# EAGLE design Output (EAGLE 9.2.2)
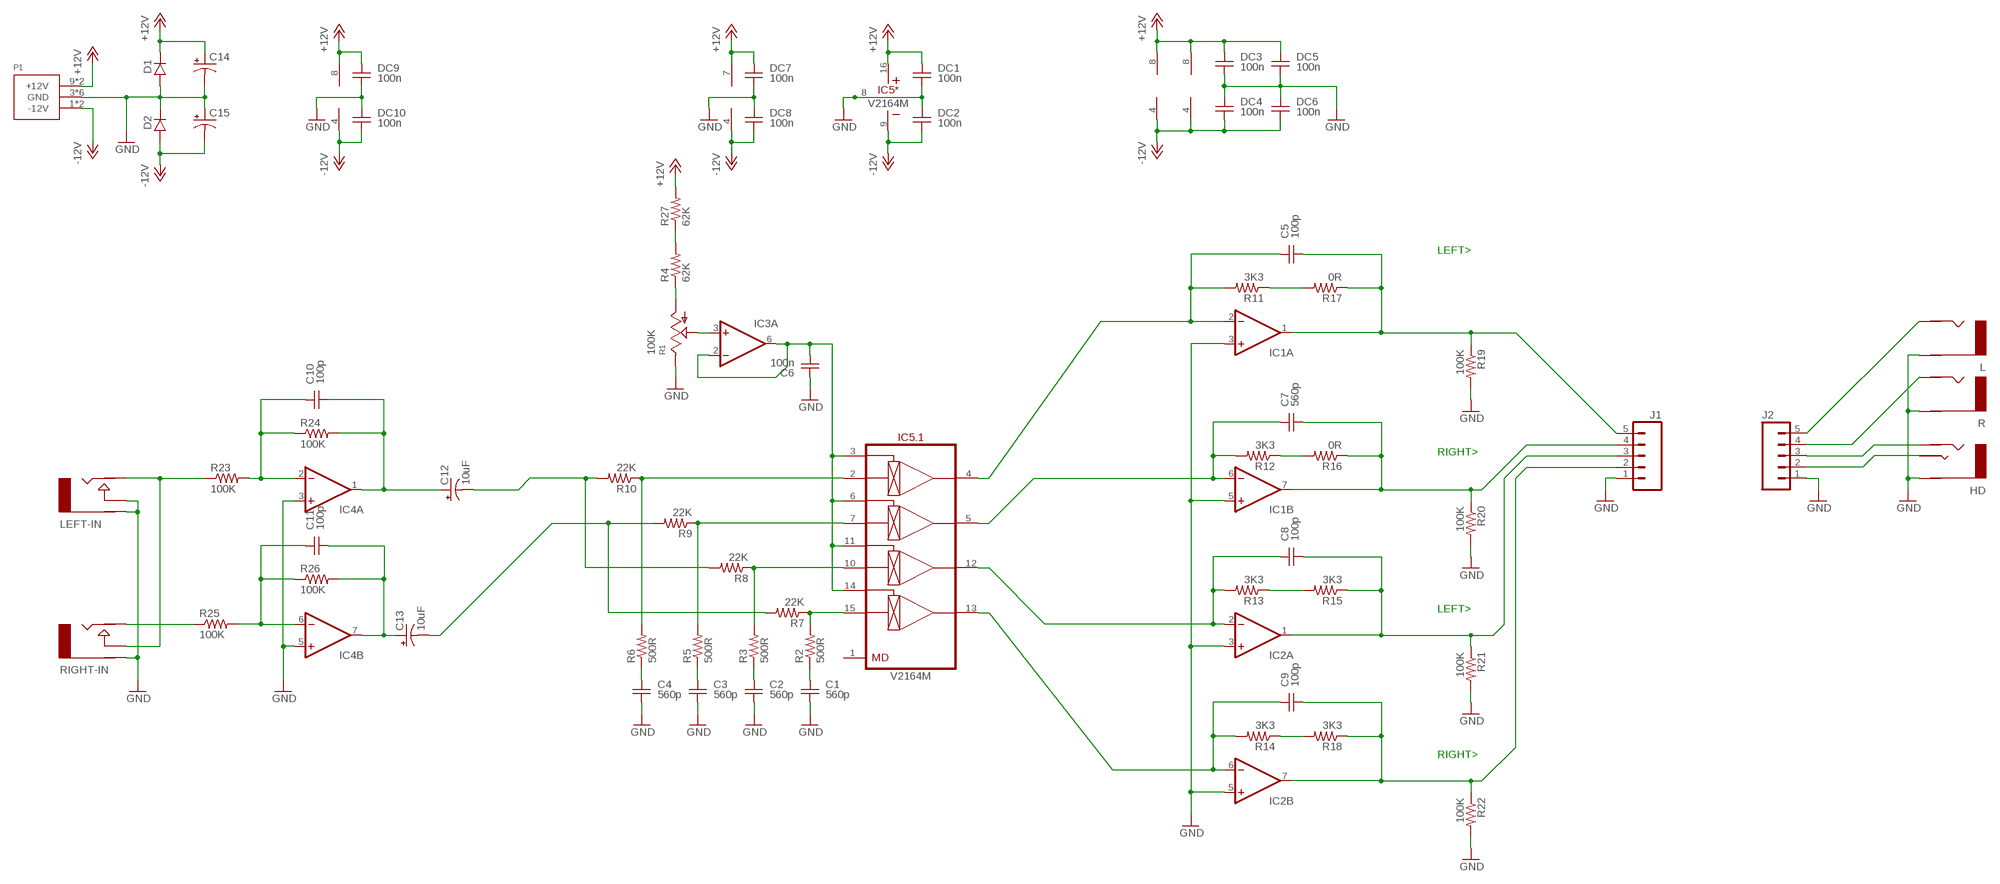
[diagram p0: schematic, sheet 1]

## Parts
C1  560p  CAPACITOR0805  [C-0805]
C2  560p  CAPACITOR0805  [C-0805]
C3  560p  CAPACITOR0805  [C-0805]
C4  560p  CAPACITOR0805  [C-0805]
C5  100p  CAPACITOR0805  [C-0805]
C6  100n  CAPACITOR0805  [C-0805]
C7  560p  CAPACITOR0805  [C-0805]
C8  100p  CAPACITOR0805  [C-0805]
C9  100p  CAPACITOR0805  [C-0805]
C10  100p  CAPACITOR0805  [C-0805]
C11  100p  CAPACITOR0805  [C-0805]
C12  10uF  CAP_POLC  [PANASONIC_C]
C13  10uF  CAP_POLC  [PANASONIC_C]
C14  CAP_POLPTH2  [CPOL-RADIAL-10UF-25V]
C15  CAP_POLPTH2  [CPOL-RADIAL-10UF-25V]
D1  DIODESMA  [SMA]
D2  DIODESMA  [SMA]
DC1  100n  CAPACITOR0805  [C-0805]
DC2  100n  CAPACITOR0805  [C-0805]
DC3  100n  CAPACITOR0805  [C-0805]
DC4  100n  CAPACITOR0805  [C-0805]
DC5  100n  CAPACITOR0805  [C-0805]
DC6  100n  CAPACITOR0805  [C-0805]
DC7  100n  CAPACITOR0805  [C-0805]
DC8  100n  CAPACITOR0805  [C-0805]
DC9  100n  CAPACITOR0805  [C-0805]
DC10  100n  CAPACITOR0805  [C-0805]
HD  AUDIO-JACK_STEREO  [NJ3FD]
IC1  OPAMP-DUAL  [SO08]
IC2  OPAMP-DUAL  [SO08]
IC3  OPAMP-SINGLE  [SO08]
IC4  OPAMP-DUAL  [SO08]
IC5  V2164M  [SO-16]
J1  CONN2  M05LOCK  [1X05_LOCK]
J2  CONN  M05LOCK  [1X05_LOCK]
L  AUDIO-JACK-MONO  [NJ2FD]
LEFT-IN  AUDIO-JACKINLINE  [ERTHENVAR-JACK-INLINE]
P1  POWER_SIMPLE10_SHROUDED  [POWER_10_SHROUDED]
R  AUDIO-JACK-MONO  [NJ2FD]
R1  100K  POTALPHA-9MM  [POT-ALPHA-9MM]
R2  500R  RESISTOR0805  [R-0805-MILL]
R3  500R  RESISTOR0805  [R-0805-MILL]
R4  62K  RESISTOR0805  [R-0805-MILL]
R5  500R  RESISTOR0805  [R-0805-MILL]
R6  500R  RESISTOR0805  [R-0805-MILL]
R7  22K  RESISTOR0805  [R-0805-MILL]
R8  22K  RESISTOR0805  [R-0805-MILL]
R9  22K  RESISTOR0805  [R-0805-MILL]
R10  22K  RESISTOR0805  [R-0805-MILL]
R11  3K3  RESISTOR0805  [R-0805-MILL]
R12  3K3  RESISTOR0805  [R-0805-MILL]
R13  3K3  RESISTOR0805  [R-0805-MILL]
R14  3K3  RESISTOR0805  [R-0805-MILL]
R15  3K3  RESISTOR0805  [R-0805-MILL]
R16  0R  RESISTOR0805  [R-0805-MILL]
R17  0R  RESISTOR0805  [R-0805-MILL]
R18  3K3  RESISTOR0805  [R-0805-MILL]
R19  100K  RESISTOR0805  [R-0805-MILL]
R20  100K  RESISTOR0805  [R-0805-MILL]
R21  100K  RESISTOR0805  [R-0805-MILL]
R22  100K  RESISTOR0805  [R-0805-MILL]
R23  100K  RESISTOR0805  [R-0805-MILL]
R24  100K  RESISTOR0805  [R-0805-MILL]
R25  100K  RESISTOR0805  [R-0805-MILL]
R26  100K  RESISTOR0805  [R-0805-MILL]
R27  62K  RESISTOR0805  [R-0805-MILL]
RIGHT-IN  AUDIO-JACKINLINE  [ERTHENVAR-JACK-INLINE]

## Nets
+12V: C14.1(+) D1.K(C) DC1.1 DC3.1 DC5.1 DC7.1 DC9.1 IC1.8(POWER:V+) IC2.8(POWER:V+) IC3.7(POWER:V+) IC4.8(POWER:V+) IC5.16(*:V+) P1.9(+12V) P1.10(+12V) R27.P$2
-12V: C15.2(-) D2.A DC2.2 DC4.2 DC6.2 DC8.2 DC10.2 IC1.4(POWER:V-) IC2.4(POWER:V-) IC3.4(POWER:V-) IC4.4(POWER:V-) IC5.9(*:V-) P1.1(-12V) P1.2(-12V)
GND: C1.2 C2.2 C3.2 C4.2 C6.1 C14.2(-) C15.1(+) D1.A D2.K(C) DC1.2 DC2.1 DC3.2 DC4.1 DC5.2 DC6.1 DC7.2 DC8.1 DC9.2 DC10.1 HD.R(RING) IC1.3(A:+IN) IC1.5(B:+IN) IC2.3(A:+IN) IC2.5(B:+IN) IC4.3(A:+IN) IC4.5(B:+IN) IC5.8(*:GND) J1.1 J2.1 L.S(RING) LEFT-IN.G(RING) LEFT-IN.N(NORM) P1.3(GND) P1.4(GND) P1.5(GND) P1.6(GND) P1.7(GND) P1.8(GND) R1.B(E) R19.P$2 R20.P$2 R21.P$2 R22.P$2 R.S(RING) RIGHT-IN.G(RING)
LEFT-IN: LEFT-IN.T(TIP) R23.P$1 RIGHT-IN.N(NORM)
LEFT-IN-BUFF: C12.- R8.P$2 R10.P$2
N$1: R1.A R4.P$1
N$2: IC5.2(.1:IN1) R6.P$2 R10.P$1
N$3: C6.2 IC3.2(A:-IN) IC3.6(A:OUT) IC5.3(.1:CV1) IC5.6(.1:CV2) IC5.11(.1:CV3) IC5.14(.1:CV4)
N$4: IC5.7(.1:IN2) R5.P$2 R9.P$1
N$5: IC5.10(.1:IN3) R3.P$2 R8.P$1
N$6: IC5.15(.1:IN4) R2.P$2 R7.P$1
N$7: C1.1 R2.P$1
N$8: J2.5 L.T(TIP)
N$9: C2.1 R3.P$1
N$10: C3.1 R5.P$1
N$11: C4.1 R6.P$1
N$12: R14.P$1 R18.P$2
N$13: C9.2 IC2.7(B:OUT) J1.2 R18.P$1 R22.P$1
N$14: J2.4 R.T(TIP)
N$15: C5.1 IC1.2(A:-IN) IC5.4(.1:OUT1) R11.P$2
N$16: C7.1 IC1.6(B:-IN) IC5.5(.1:OUT2) R12.P$2
N$17: C8.1 IC2.2(A:-IN) IC5.12(.1:OUT3) R13.P$2
N$18: C9.1 IC2.6(B:-IN) IC5.13(.1:OUT4) R14.P$2
N$19: C5.2 IC1.1(A:OUT) J1.5 R17.P$1 R19.P$1
N$20: IC3.3(A:+IN) R1.W(S)
N$21: R13.P$1 R15.P$2
N$22: C7.2 IC1.7(B:OUT) J1.4 R16.P$1 R20.P$1
N$23: R12.P$1 R16.P$2
N$24: C8.2 IC2.1(A:OUT) J1.3 R15.P$1 R21.P$1
N$25: R11.P$1 R17.P$2
N$26: HD.T(TIP) J2.3
N$27: HD.S(SLEEVE) J2.2
N$28: C10.1 IC4.2(A:-IN) R23.P$2 R24.P$1
N$29: C11.1 IC4.6(B:-IN) R25.P$2 R26.P$1
N$30: C10.2 C12.+ IC4.1(A:OUT) R24.P$2
N$31: C11.2 C13.+ IC4.7(B:OUT) R26.P$2
N$32: R4.P$2 R27.P$1
RIGHT-IN: R25.P$1 RIGHT-IN.T(TIP)
RIGHT-IN-BUFF: C13.- R7.P$2 R9.P$2
Unconnected: IC5.1(.1:MD)

## Notes on the sheet
- LEFT>
- RIGHT>
- LEFT>
- RIGHT>

## Library data of the parts
C1-C11 DC1-DC10 = barsstronics:CAPACITOR
C12 C13 = SparkFun-Passives:CAP_POL: Capacitor Polarized These are standard SMD and PTH capacitors. Normally 10uF, 47uF, and 100uF in electrolytic and tantalum varieties. Always verify the external diameter of the through hole cap, it varies with capacity, voltage, and manufacturer. The EIA devices should be standard.
C14 C15 = SparkFun-Capacitors:CAP_POL: Capacitor Polarized These are standard SMD and PTH capacitors. Normally 10uF, 47uF, and 100uF in electrolytic and tantalum varieties. Always verify the external diameter of the through hole cap, it varies with capacity, voltage, and manufacturer. The EIA devices should be standard.
D1 D2 = barsstronics:DIODE
HD = barsstronics:AUDIO-JACK_STEREO
IC1 IC2 IC4 = barsstronics:OPAMP-DUAL: Generic Dual Op-Amp
IC3 = barsstronics:OPAMP-SINGLE
IC5 = ic-coolaudio:V2164
J1 J2 = SparkFun-Connectors:M05: Header 5 Standard 5-pin 0.1" header. Use with straight break away headers (SKU : PRT-00116), right angle break away headers (PRT-00553), swiss pins (PRT-00743), machine pins (PRT-00117), and female headers (PRT-00115). Molex polarized connector foot print use with SKU : PRT-08230 with associated crimp pins and housings.
L R = barsstronics:AUDIO-JACK-MONO
LEFT-IN RIGHT-IN = erthenvar:AUDIO-JACK: Switching Mono 3.5mm Audio Jack from Erthenvar. Horizontal package.
P1 = eurorack:POWER_SIMPLE
R1 = barsstronics:POT
R2-R27 = barsstronics:RESISTOR

## Board
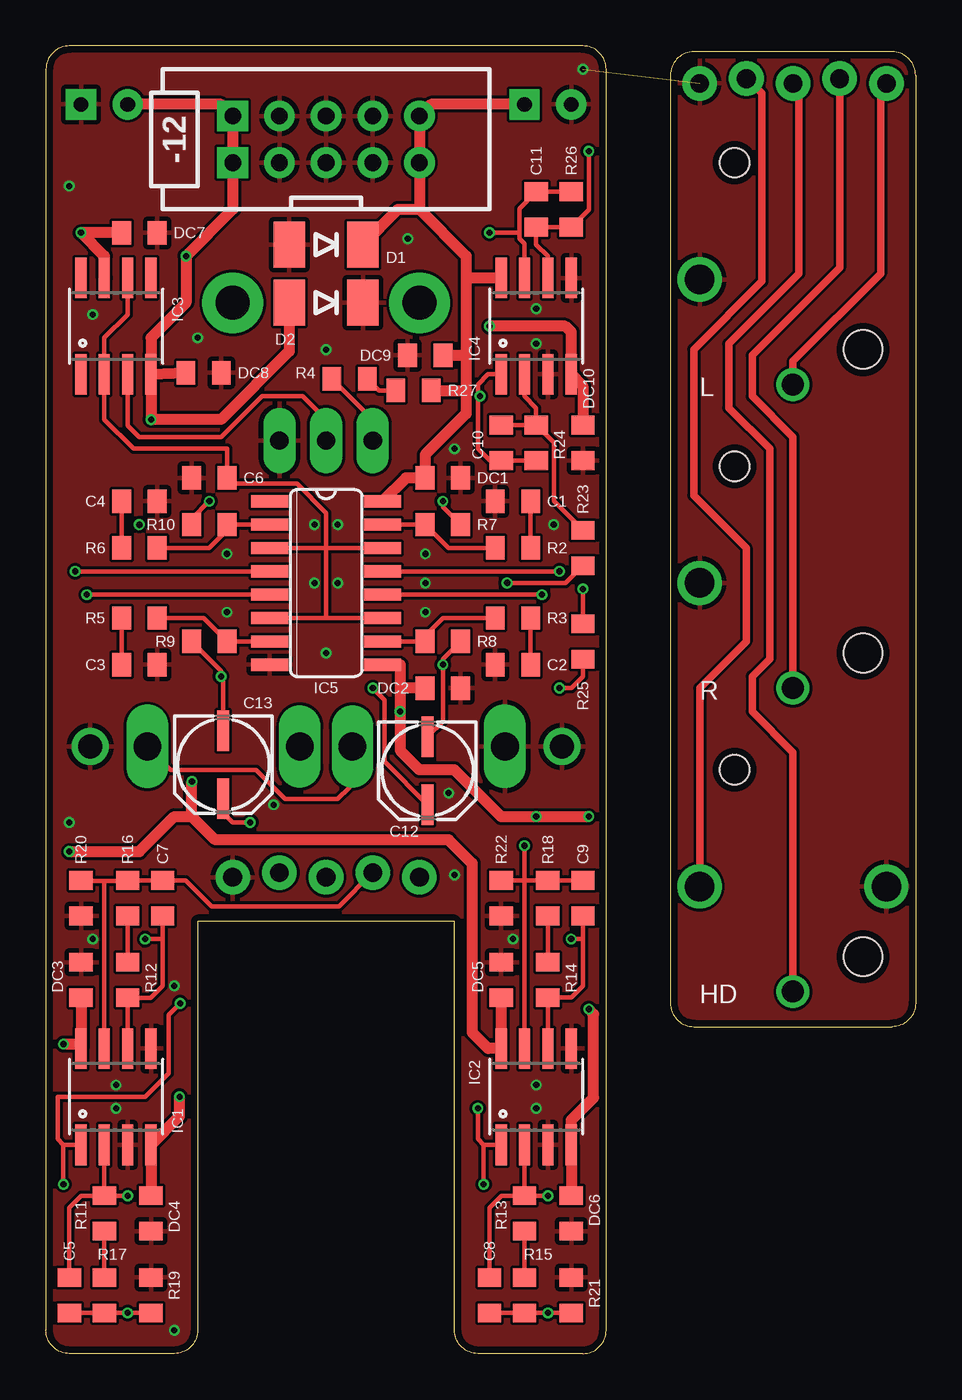
[diagram p1: board, top side]
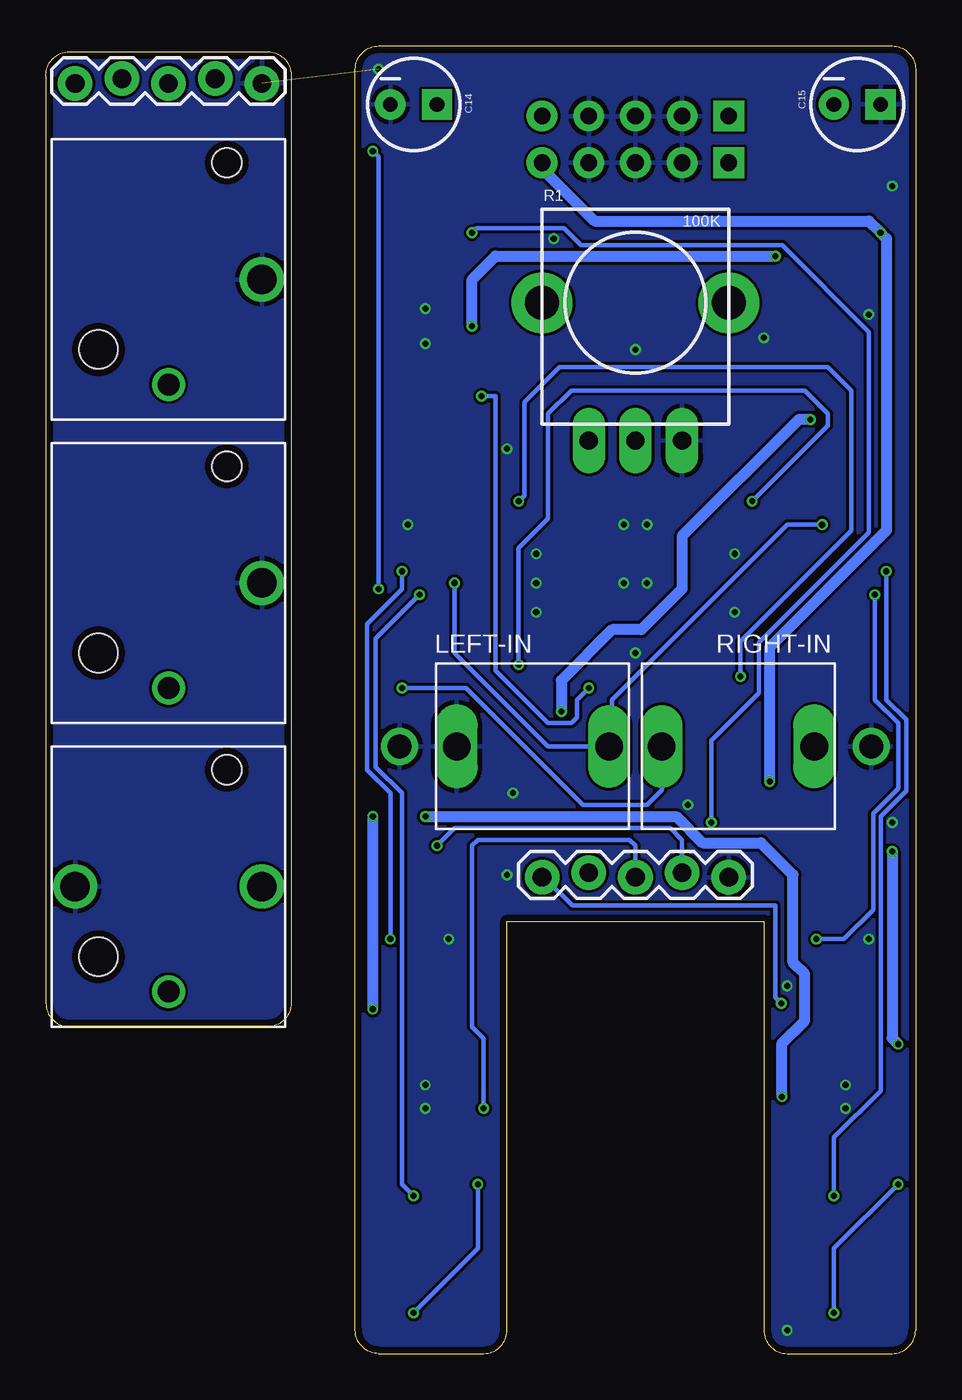
[diagram p2: board, bottom side, seen from below]

Size 47.31 x 71.12 mm. Coordinates in mm from the lower left corner, seen from the top.
Outline: 8.26,23.5 8.26,1.27 arc-90 6.99,0 1.27,0 arc-90 0,1.27 0,69.85 arc-90 1.27,71.12 29.21,71.12 arc-90 30.48,69.85 30.48,1.27 arc-90 29.21,0 23.5,0 arc-90 22.23,1.27 22.23,23.5 8.26,23.5
Outline: 47.31,69.53 47.31,19.05 arc-90 46.04,17.78 35.24,17.78 arc-90 33.97,19.05 33.97,69.53 arc-90 35.24,70.8 46.04,70.8 arc-90 47.31,69.53
Copper layers (1*16): Top 0.035559375mm / dielectric 1.6mm / Bottom 0.035559375mm
Design rules "oshpark-2layer": minimum track width 6mil, minimum drill 10mil, track to track 6mil, track to pad 6mil, pad to pad 6mil, via to via 6mil, smd to smd 6mil, copper to edge 15mil, drill to drill 6mil, minimum pad ring 5mil, minimum via ring 5mil, stop-mask expansion 2.5mil, vias tented up to drill 0mil, thermal gap 10mil

### Footprints (pad centres in the part's own frame; a part is rotated, then mirrored left to right if it is on the bottom)
C-0805 = smd 1.016 x 1.27: 1 -0.965,0; 2 0.965,0
PANASONIC_C = smd 2.2 x 0.65: + 1.9,-0.2; - -1.8,-0.2
CPOL-RADIAL-10UF-25V = drill 0.8 pad 1.651 square: 1 1.27,0 | drill 0.8 pad 1.651: 2 -1.27,0
SMA = smd 1.7 x 2.5: A -2,0; K 2,0
NJ3FD = drill 1.6: R -5.08,0; S 5.08,0 | drill 1.194: T 0,-5.715 | hole 2.108: -3.81,-3.81 | hole 1.6: 3.175,6.35
SO08 = smd 0.61 x 2.21: 1 -1.905,-2.616; 2 -0.635,-2.616; 3 0.635,-2.616; 4 1.905,-2.616; 5 1.905,2.616; 6 0.635,2.616; 7 -0.635,2.616; 8 -1.905,2.616
SO-16 = smd 0.66 x 2.032: 1 -4.445,-3.073; 2 -3.175,-3.073; 3 -1.905,-3.073; 4 -0.635,-3.073; 5 0.635,-3.073; 6 1.905,-3.073; 7 3.175,-3.073; 8 4.445,-3.073; 9 4.445,3.073; 10 3.175,3.073; 11 1.905,3.073; 12 0.635,3.073; 13 -0.635,3.073; 14 -1.905,3.073; 15 -3.175,3.073; 16 -4.445,3.073
1X05_LOCK = drill 1.016 pad 1.88: 1 0,0.127; 2 2.54,-0.127; 3 5.08,0.127; 4 7.62,-0.127; 5 10.16,0.127
NJ2FD = drill 1.6: S 5.08,0 | drill 1.194: T 0,-5.715 | hole 2.108: -3.81,-3.81 | hole 1.6: 3.175,6.35
ERTHENVAR-JACK-INLINE = drill 1.3 pad 2.032: G 0,-6.48 | drill 1.5 pad 2.286 long: N 0,-3.38 | drill 1.5 pad 2.235 long: T 0,4.92
POWER_10_SHROUDED = drill 0.9 pad 1.676 square: 1 -5.08,-1.27; 2 -5.08,1.27 | drill 0.9 pad 1.676: 3 -2.54,-1.27; 4 -2.54,1.27; 5 0,-1.27; 6 0,1.27; 7 2.54,-1.27; 8 2.54,1.27; 9 5.08,-1.27; 10 5.08,1.27
POT-ALPHA-9MM = drill 1 pad 1.778 long: A -2.54,-7.493; B 2.54,-7.493; W 0,-7.493 | drill 1.85 pad 3.302: MNT1 -5.08,0; MNT2 5.08,0
R-0805-MILL = smd 1.016 x 1.27: P$1 -0.965,0; P$2 0.965,0

### Placement (x,y rotation side)
C1  25.4,46.35 180 top
C2  25.4,37.47 180 top
C3  5.08,37.47 0 top
C4  5.08,46.35 0 top
C5  1.27,3.17 270 top
C6  8.89,47.62 0 top
C7  6.35,24.77 90 top
C8  24.13,3.17 270 top
C9  29.21,24.77 90 top
C10  24.77,49.53 270 top
C11  26.67,62.23 90 top
C12  20.95,31.75 270 top
C13  9.84,32.07 270 top
C14  27.3,67.94 0 bottom
C15  3.17,67.94 0 bottom
D1  15.24,60.33 0 top
D2  15.24,57.15 0 top
DC1  21.59,47.62 0 top
DC2  21.59,36.2 180 top
DC3  1.91,20.32 90 top
DC4  5.71,7.62 90 top
DC5  24.77,20.32 90 top
DC6  28.57,7.62 90 top
DC7  5.08,60.96 0 top
DC8  8.57,53.34 180 top
DC9  20.64,54.29 180 top
DC10  29.21,49.53 90 top
HD  40.64,25.4 0 bottom
IC1  3.81,13.97 0 top
IC2  26.67,13.97 0 top
IC3  3.81,55.88 0 top
IC4  26.67,55.88 0 top
IC5  15.24,41.91 270 top
J1  10.16,26.04 180 bottom
J2  35.56,69.22 180 bottom
L  40.64,58.42 0 bottom
LEFT-IN  21.59,33.02 270 bottom
P1  15.24,66.04 0 top
R  40.64,41.91 0 bottom
R1  15.24,57.15 0 bottom
R2  25.4,43.81 180 top
R3  25.4,40.01 180 top
R4  16.51,53.02 0 top
R5  5.08,40.01 0 top
R6  5.08,43.81 0 top
R7  21.59,45.09 0 top
R8  21.59,38.73 0 top
R9  8.89,38.73 180 top
R10  8.89,45.09 180 top
R11  3.17,7.62 90 top
R12  4.45,20.32 270 top
R13  26.04,7.62 90 top
R14  27.3,20.32 270 top
R15  26.04,3.17 90 top
R16  4.45,24.77 270 top
R17  3.17,3.17 90 top
R18  27.3,24.77 270 top
R19  5.71,3.17 90 top
R20  1.91,24.77 270 top
R21  28.57,3.17 90 top
R22  24.77,24.77 270 top
R23  29.21,43.81 90 top
R24  26.67,49.53 270 top
R25  29.21,38.73 90 top
R26  28.57,62.23 90 top
R27  20,52.39 0 top
RIGHT-IN  8.89,33.02 90 bottom

### Tracks (layer width: path | path; a pad name or v marks a point on that pad's centre or on a via)
+12V  (via drill 0.33)
  Top 0.61: IC5.16 19.58,47.62 DC1.1 20.62,48.88 22.86,51.12 22.86,52.39 | DC3.1 IC1.8 1.66,16.83 v0.95,16.83 | DC5.1 IC2.8 24.05,16.59 23.18,17.46 23.18,26.67 21.91,27.94 9.21,27.94 7.94,29.21 | v1.27,27.3 5.08,27.3 6.99,29.21 7.94,29.21 | 7.94,29.21 v7.94,31.11 | DC7.1 v1.91,60.96 3.17,59.69 IC3.7 | 20.32,62.23 P1.9 P1.10 20.95,67.94 C14.1 | 20.32,62.23 22.86,59.69 22.86,58.42 | 22.86,58.42 22.86,54.29 | 22.86,54.29 22.86,52.39 | IC4.8 22.94,58.5 22.86,58.42 | DC9.1 22.86,54.29 | D1.K 19.14,62.23 20.32,62.23 | R27.P$2 22.86,52.39
  Bottom 0.61: v7.94,31.11 7.94,38.42 1.59,44.77 1.59,60.64 v1.91,60.96 2.54,61.59 17.46,61.59 20.32,64.45 P1.9 | v1.27,27.3 1.27,17.14 v0.95,16.83
-12V  (via drill 0.33)
  Top 0.61: DC2.2 19.27,36.2 | IC5.9 19.27,37.47 19.27,36.2 | IC3.4 DC8.2 | DC4.2 IC1.4 7.25,12.89 7.25,13.96 7.26,13.96 v7.26,13.97 | DC6.2 IC2.4 28.57,12.7 29.79,13.92 29.79,18.47 v29.53,18.73 | 19.27,36.2 v19.27,34.92 19.27,32.8 20.32,31.75 22.23,31.75 24.77,29.21 v26.67,29.21 v29.53,29.21 | IC3.4 v5.71,50.8 9.53,50.8 13.24,54.52 D2.A | IC3.4 5.71,55.24 7.62,57.15 v7.62,59.69 10.16,62.23 P1.1 P1.2 9.53,67.94 C15.2 | DC10.2 29.21,52.63 IC4.4 28.57,55.56 28.26,55.88 v24.13,55.88
  Bottom 0.61: v7.26,13.97 7.26,16.87 6.03,18.1 6.03,20.64 6.67,21.27 6.67,26.04 8.41,27.78 11.59,27.78 13.02,29.21 v26.67,29.21 | v29.53,29.21 v29.53,18.73 | v5.71,50.8 6.35,50.8 12.7,44.45 12.7,41.59 14.92,39.37 16.51,39.37 19.27,36.61 v19.27,34.92 | v24.13,55.88 24.13,58.42 22.86,59.69 v7.62,59.69
GND  (via drill 0.33)  (1 unrouted)
  other vias: 6.99,1.27 26.67,14.61 3.81,14.61 25.4,22.54 2.54,22.54 15.24,38.1 6.99,20 3.81,13.34 26.67,13.34 1.27,28.89 14.61,41.91 15.88,41.91 14.61,45.09 9.84,40.32 9.84,43.5 20.64,43.5 20.64,40.32 26.67,54.93 22.23,49.21 26.67,56.83 22.23,26.04 15.24,54.61 29.21,69.85 1.27,63.5 8.26,55.24 19.68,60.64 2.54,56.52 15.88,45.09 27.62,45.09 12.38,29.84 21.91,30.48 20.64,41.91
  pour Bottom: 33.97,70.8 47.31,70.8 47.31,17.78 33.97,17.78
  pour Top: 0,0 0,71.12 30.48,71.12 30.48,0 22.23,0 22.23,23.18 8.26,23.18 8.26,0
  pour Bottom: 22.23,0 22.23,23.18 8.26,23.18 8.26,0 0,0 0,71.12 30.48,71.12 30.48,0
  pour Top: 33.97,70.8 47.31,70.8 47.31,17.78 33.97,17.78
LEFT-IN  (via drill 0.35)
  Top 0.254: LEFT-IN.T 16.51,32.86 16.51,30.8 15.88,30.16 13.02,30.16 11.43,31.75 6.78,31.75 RIGHT-IN.N | R23.P$1 29.2,42.85 28.26,41.91 v25.08,41.91
  Bottom 0.254: v5.08,45.09 6.99,45.09 16.51,35.56 16.51,33.18 LEFT-IN.T 20,33.02 25.08,38.1 v25.08,41.91
LEFT-IN-BUFF  (via drill 0.33)
  Top 0.254: R10.P$2 7.92,45.39 v8.89,46.35 | R8.P$2 21.6,37.78 21.59,37.78 v21.59,37.47 21.59,34.38 C12.-
  Bottom 0.254: v8.89,46.35 4.76,50.48 4.76,51.12 6.03,52.39 18.73,52.39 20,51.12 20,45.4 21.59,43.81 v21.59,37.47
N$1
  Top 0.254: R4.P$1 17.78,50.79 R1.A
N$2
  Top 0.254: R10.P$1 10.16,45.09 | 10.16,45.09 IC5.2 | R6.P$2 8.89,43.81 10.16,45.09
N$3
  Top 0.254: IC5.14 15.24,43.81 | 15.24,43.81 IC5.3 | IC5.6 15.24,40.01 | 15.24,40.01 IC5.11 | 15.24,43.81 15.24,40.01 | IC3.6 4.45,56.52 3.17,55.24 IC3.2 3.17,50.8 4.76,49.21 9.84,49.21 9.84,47.64 C6.2 10.17,47.31 13.65,47.31 15.24,45.72 15.24,43.81
N$4
  Top 0.254: IC5.7 R9.P$1 8.59,40.01 R5.P$2
N$5
  Top 0.254: R8.P$1 20.32,38.73 | 20.32,38.73 IC5.10 | R3.P$2 21.59,40.01 20.32,38.73
N$6
  Top 0.254: IC5.15 R7.P$1 21.89,43.81 R2.P$2
N$7
  Top 0.254: C1.1 R2.P$1
N$8
  Top 0.406: J2.5 45.4,68.77 45.4,58.74 40.64,53.98 L.T
N$9
  Top 0.254: C2.1 R3.P$1
N$10
  Top 0.254: R5.P$1 C3.1
N$11
  Top 0.254: C4.1 R6.P$1
N$12
  Top 0.254: R18.P$2 R14.P$1
N$13  (via drill 0.33)
  Top 0.254: 26.04,25.73 R18.P$1 C9.2 | 26.04,25.73 R22.P$1 | IC2.7 26.04,25.73 | v26.04,27.62 26.04,25.73
  Bottom 0.254: J1.2 12.7,27.94 13.34,28.57 25.08,28.57 v26.04,27.62
N$14
  Top 0.406: J2.4 43.18,59.05 38.42,54.29 38.42,52.07 40.64,49.85 R.T
N$15  (via drill 0.33)
  Top 0.254: IC5.4 v1.59,42.55 | R11.P$2 1.92,8.59 1.27,7.94 C5.1 | IC1.2 R11.P$2 | R11.P$2 3.19,8.57 v4.45,8.57
  Bottom 0.254: v1.59,42.55 1.59,35.56 0.51,34.48 0.51,30.61 1.91,29.21 1.91,14.29 4.45,11.75 v4.45,8.57
N$16  (via drill 0.33)
  Top 0.254: IC1.6 R12.P$2 5.7,19.36 6.35,20 6.35,22.54 | C7.1 6.35,22.54 | IC5.5 v2.22,41.27 | v5.4,22.54 6.35,22.54
  Bottom 0.254: v2.22,41.27 2.22,35.56 0.95,34.29 0.95,30.74 2.31,29.38 2.31,24.13 3.9,22.54 v5.4,22.54
N$17  (via drill 0.33)
  Top 0.254: IC5.12 v26.99,41.27 | IC2.2 R13.P$2 | R13.P$2 24.78,8.59 24.13,7.94 C8.1 | v27.3,8.57 26.05,8.57 R13.P$2
  Bottom 0.254: v26.99,41.27 29.36,38.9 29.36,31.91 27.94,30.48 27.94,9.21 v27.3,8.57
N$18  (via drill 0.33)
  Top 0.254: IC2.6 R14.P$2 27.32,19.37 28.57,19.37 29.21,20 29.21,22.54 | C9.1 29.21,22.54 | 29.21,22.54 v28.57,22.54 | v27.94,42.55 IC5.13
  Bottom 0.254: v28.57,22.54 28.57,30.48 29.84,31.75 29.84,39.69 27.94,41.59 v27.94,42.55
N$19  (via drill 0.33)
  Top 0.254: R19.P$1 v4.45,2.21 R17.P$1 C5.2 | 0.95,11.35 v0.95,9.21 | 0.95,11.35 0.64,11.67 0.64,13.97 5.4,13.97 6.67,15.24 6.67,18.41 v7.3,19.05 | IC1.1 0.95,11.35
  Bottom 0.254: v0.95,9.21 4.45,5.71 v4.45,2.21 | J1.5 20.2,25.91 18.67,24.37 7.62,24.37 7.62,19.37 v7.3,19.05
N$20
  Top 0.254: R1.W 15.24,50.8 13.97,52.07 11.75,52.07 9.53,49.85 5.08,49.85 4.45,50.48 IC3.3
N$21
  Top 0.254: R13.P$1 R15.P$2
N$22
  Top 0.254: IC1.7 3.17,25.72 | 3.17,25.72 1.92,25.72 R20.P$1 | 3.17,25.72 4.43,25.72 R16.P$1 C7.2 7.61,25.73 9.02,24.32 15.94,24.32 J1.4
N$23
  Top 0.254: R16.P$2 R12.P$1
N$24  (via drill 0.33)
  Top 0.254: R21.P$1 v27.3,2.21 R15.P$1 C8.2 | IC2.1 23.81,11.35 | 23.81,11.35 v23.81,9.21 | 23.81,11.35 23.5,11.67 v23.5,13.34
  Bottom 0.254: v23.81,9.21 23.81,5.71 27.3,2.22 v27.3,2.21 | v23.5,13.34 23.5,17.14 24.13,17.78 24.13,27.62 23.81,27.94 15.56,27.94 15.24,27.62 J1.3
N$25
  Top 0.254: R11.P$1 R17.P$2
N$26
  Top 0.254: J2.3 40.96,68.77
  Top 0.406: 40.96,68.77 40.96,58.74 37.15,54.93 37.15,51.44 39.37,49.21 39.37,37.78 38.42,36.83 38.42,34.92 40.64,32.7 HD.T
N$27
  Top 0.254: J2.2 38.17,69.34
  Top 0.406: 38.17,69.34 38.95,68.56 38.95,58.32 35.24,54.61 35.24,46.67 38.1,43.81 38.1,38.73 35.56,36.2 HD.S
N$28
  Top 0.254: C10.1 R24.P$1 | IC4.2 26.04,52.07 26.67,51.44 R24.P$1 | R24.P$1 27.62,49.54 27.62,46.37 R23.P$2
N$29  (via drill 0.33)
  Top 0.254: IC4.6 27.3,59.69 26.67,60.33 C11.1 R26.P$1 29.53,62.22 v29.53,65.39 | R25.P$2 v29.21,41.59
  Bottom 0.254: v29.21,41.59 29.21,65.09 29.53,65.41 v29.53,65.39
N$30  (via drill 0.33)
  Top 0.254: R24.P$2 C10.2 24.14,48.56 23.5,49.21 23.5,52.07 | IC4.1 24.05,53.26 23.5,52.7 23.5,52.07 | C12.+ 18.41,32.19 18.41,35.56 v17.78,36.2 | v23.61,52.07 23.5,52.07
  Bottom 0.254: v17.78,36.2 18.41,35.56 18.41,34.61 18.73,34.29 20,34.29 22.86,37.15 22.86,52.07 v23.61,52.07
N$31  (via drill 0.33)
  Top 0.254: R26.P$2 C11.2 25.76,62.28 25.76,60.96 | IC4.7 26.04,60.36 25.76,60.64 25.76,60.96 | 25.76,60.96 v24.13,60.96 | v11.11,28.89 10.16,28.89 9.64,29.41 C13.+
  Bottom 0.254: v24.13,60.96 23.88,61.21 19.13,61.21 18.19,60.27 7.25,60.27 2.54,55.56 2.54,44.64 8.52,38.66 8.52,35.93 11.11,33.34 v11.11,28.89
N$32
  Top 0.254: R4.P$2 18.11,52.39 R27.P$1
RIGHT-IN  (via drill 0.33)
  Top 0.254: v27.94,36.2 28.57,36.2 29.21,36.83 R25.P$1
  Bottom 0.254: RIGHT-IN.T 13.81,30.64 14.61,29.84 18.1,29.84 24.45,36.2 v27.94,36.2
RIGHT-IN-BUFF  (via drill 0.33)
  Top 0.254: R7.P$2 21.59,46.05 v21.59,46.35 | R9.P$2 9.53,37.13 v9.53,36.83 9.64,36.71 C13.-
  Bottom 0.254: v21.59,46.35 21.27,46.67 21.27,51.75 19.37,53.66 4.76,53.66 3.49,52.39 3.49,44.77 9.53,38.73 v9.53,36.83